# EAGLE design leptonBreakout (EAGLE 6.6.0)
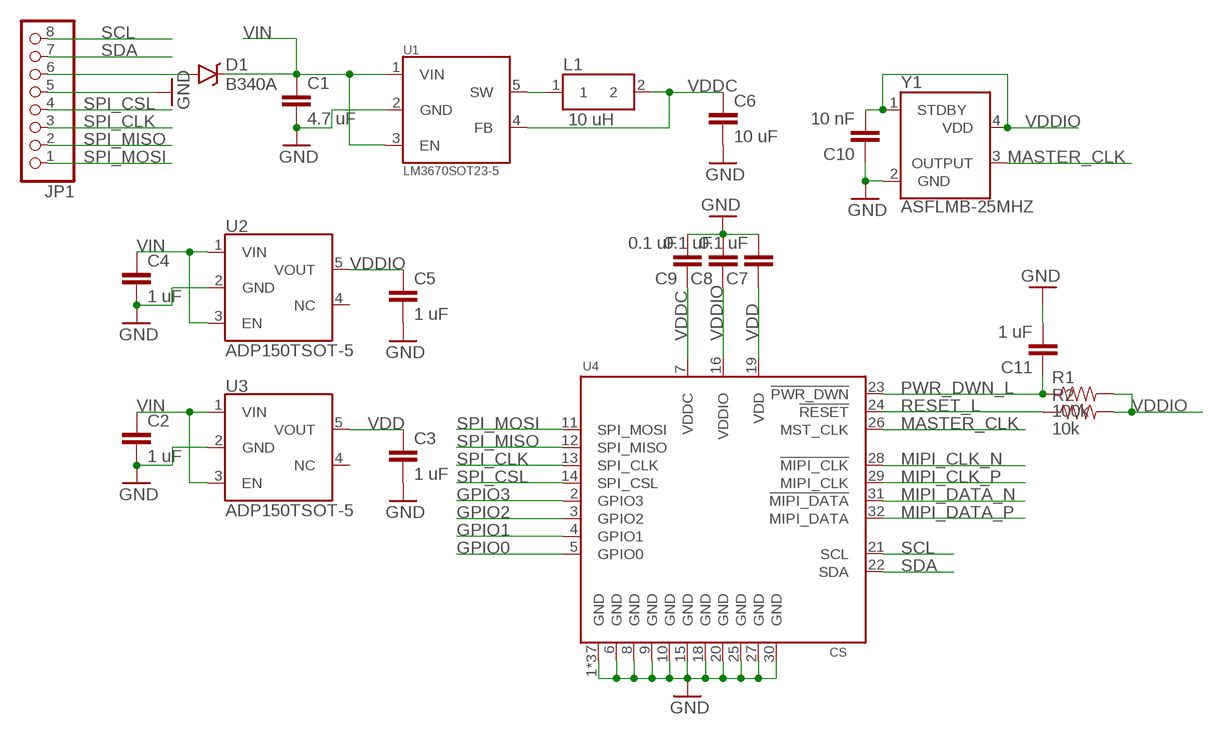
[diagram p0: schematic, sheet 1]

## Parts
C1  4.7 uF  CAP0805  [0805]
C2  1 uF  CAP0805  [0805]
C3  1 uF  CAP0805  [0805]
C4  1 uF  CAP0805  [0805]
C5  1 uF  CAP0805  [0805]
C6  10 uF  CAP0805  [0805]
C7  0.1 uF  CAP0805  [0805]
C8  0.1 uF  CAP0805  [0805]
C9  0.1 uF  CAP0805  [0805]
C10  10 nF  CAP0805  [0805]
C11  1 uF  CAP0805  [0805]
D1  B340A  DIODE-SCHOTTKY-B340A  [SMA-DIODE]
JP1  PINHD-1X8/90  [1X08/90]
L1  10 uH  SMD-INDUCTOR  [SMD-INDUCTOR]
R1  100k  RESISTOR0805-RES  [0805]
R2  10k  RESISTOR0805-RES  [0805]
U1  LM3670SOT23-5  [SOT23-5]
U2  ADP150TSOT-5  [SOT23-5]
U3  ADP150TSOT-5  [SOT23-5]
U4  CS  CAM-MODULE  [CAM-SOCKET]
Y1  ASFLMB-25MHZ  [5X3.2-CRYSTAL-OSC]

## Nets
GND: C1.2 C2.2 C3.2 C4.2 C5.2 C6.2 C7.2 C8.2 C9.2 C10.1 C11.2 JP1.5 U1.2(GND) U2.2(GND) U3.2(GND) U4.1(GND) U4.6(GND) U4.8(GND) U4.9(GND) U4.10(GND) U4.15(GND) U4.18(GND) U4.20(GND) U4.25(GND) U4.27(GND) U4.30(GND) U4.P$1(GND) U4.P$2(GND) U4.P$3(GND) U4.P$4(GND) U4.P$5(GND) U4.P$6(GND) U4.P$7(GND) U4.P$8(GND) U4.P$9(GND) U4.P$10(GND) U4.P$11(GND) U4.P$12(GND) U4.P$13(GND) U4.P$14(GND) U4.P$15(GND) U4.P$16(GND) U4.P$17(GND) U4.P$18(GND) U4.P$19(GND) U4.P$20(GND) U4.P$21(GND) U4.P$22(GND) U4.P$23(GND) U4.P$24(GND) U4.P$25(GND) U4.P$26(GND) U4.P$27(GND) U4.P$28(GND) U4.P$29(GND) U4.P$30(GND) U4.P$31(GND) U4.P$32(GND) U4.P$33(GND) U4.P$34(GND) U4.P$35(GND) U4.P$36(GND) Y1.2(GND)
GPIO0: U4.5(GPIO0)
GPIO1: U4.4(GPIO1)
GPIO2: U4.3(GPIO2)
GPIO3: U4.2(GPIO3)
MASTER_CLK: U4.26(MST_CLK) Y1.3(OUTPUT)
MIPI_CLK_N: U4.28(!MIPI_CLK)
MIPI_CLK_P: U4.29(MIPI_CLK)
MIPI_DATA_N: U4.31(!MIPI_DATA)
MIPI_DATA_P: U4.32(MIPI_DATA)
N$1: L1.1 U1.5(SW)
N$4: D1.A JP1.6
PWR_DWN_L: C11.1 R1.1 U4.23(!PWR_DWN)
RESET_L: R2.1 U4.24(!RESET)
SCL: JP1.8 U4.21(SCL)
SDA: JP1.7 U4.22(SDA)
SPI_CLK: JP1.3 U4.13(SPI_CLK)
SPI_CSL: JP1.4 U4.14(SPI_CSL)
SPI_MISO: JP1.2 U4.12(SPI_MISO)
SPI_MOSI: JP1.1 U4.11(SPI_MOSI)
VDD: C3.1 C7.1 U3.5(VOUT) U4.19(VDD)
VDDC: C6.1 C9.1 L1.2 U1.4(FB) U4.7(VDDC)
VDDIO: C5.1 C8.1 C10.2 R1.2 R2.2 U2.5(VOUT) U4.16(VDDIO) Y1.1(STDBY) Y1.4(VDD)
VIN: C1.1 C2.1 C4.1 D1.C U1.1(VIN) U1.3(EN) U2.1(VIN) U2.3(EN) U3.1(VIN) U3.3(EN)
Unconnected: U2.4(NC) U3.4(NC)

## Library data of the parts
C1-C11 = SparkFun-Capacitors:CAP: Capacitor Standard 0603 ceramic capacitor, and 0.1" leaded capacitor.
D1 = leptonCustom:DIODE-SCHOTTKY: Schottky diodes in SFE's production catalog BAT20J 1A 23V 0.62Vf RB751 120mA 40V 0.37Vf PMEG4005EJ 0.5A 40V 0.42Vf MBRA140 1A 40V 0.5Vf B340A 3A 40V SMA; PROD_ID: DIO-09886
JP1 = pinhead:PINHD-1X8: PIN HEADER
L1 = leptonCustom:SMD-INDUCTOR
R1 R2 = SparkFun-Resistors:RESISTOR: Resistor Basic schematic elements and footprints for 0603, 1206, and PTH resistors.
U1 = leptonCustom:LM3670: LM3670 1.2V 350mA Mini Buck Converter TI LM3670MF-1.2/NOPB
U2 U3 = leptonCustom:ADP150: ADP150 2.8V 150mA Linear LDO Regulator Analog Devices ADP150AUJZ-2.8-R7
U4 = leptonCustom:CAM-MODULE: FLIR Lepton 80x60 LWIR camera module.
Y1 = leptonCustom:ASFLMB-25MHZ: 25 MHz crystal oscillator.

## Board
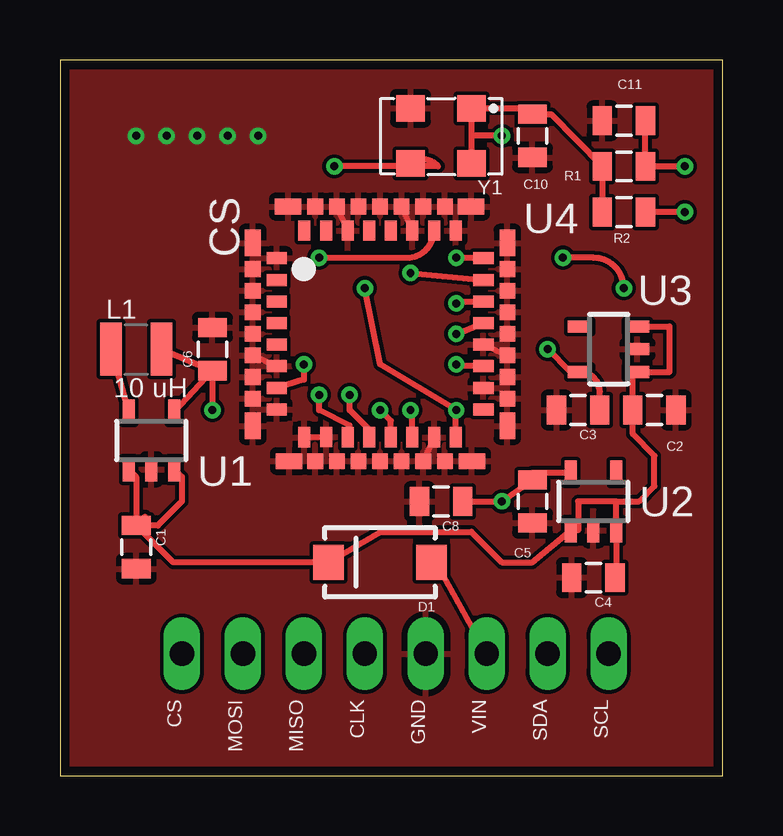
[diagram p1: board, top side]
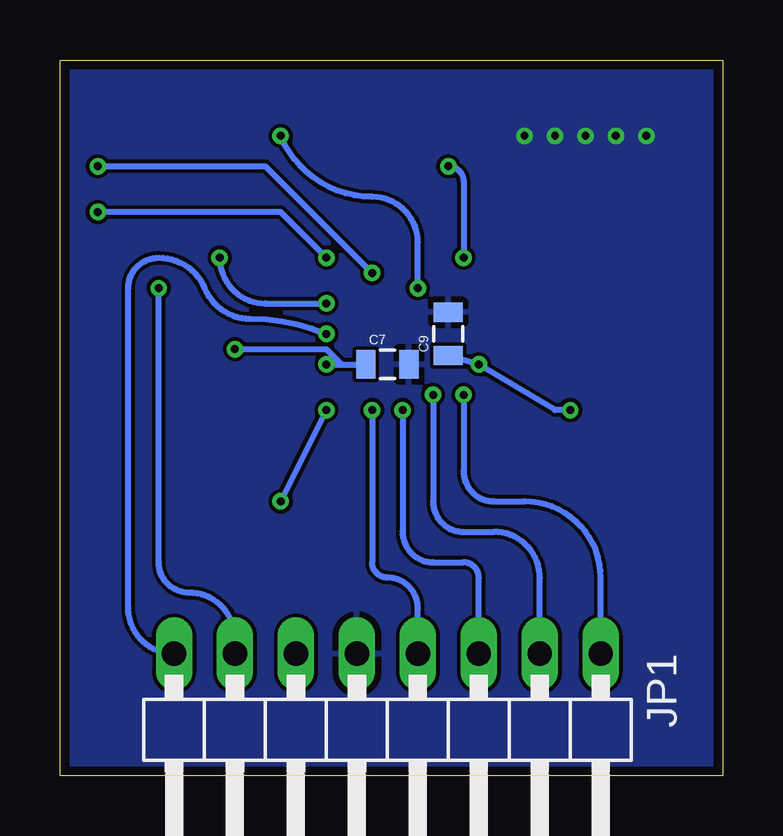
[diagram p2: board, bottom side, seen from below]

Size 27.61 x 29.84 mm. Coordinates in mm from the lower left corner, seen from the top.
Outline: 0,0 27.61,0 27.61,29.84 0,29.84 0,0
Copper layers (1*16): Top 0.0356mm / dielectric 1.5011mm / Bottom 0.0356mm
Design rules "LaenPCBOrder *": minimum track width 6mil, minimum drill 13mil, track to track 6mil, track to pad 6mil, pad to pad 6mil, via to via 6mil, smd to smd 6mil, copper to edge 15mil, drill to drill 6mil, minimum pad ring 7mil, minimum via ring 7mil, stop-mask expansion 3mil, vias tented up to drill 14mil, thermal gap 10mil

### Footprints (pad centres in the part's own frame; a part is rotated, then mirrored left to right if it is on the bottom)
0805 = smd 0.8 x 1.2: 1 -0.9,0; 2 0.9,0
SMA-DIODE = smd 1.27 x 1.47: A -2.15,0; C 2.15,0
1X08/90 = drill 1.016 long: 1 -8.89,-3.81; 2 -6.35,-3.81; 3 -3.81,-3.81; 4 -1.27,-3.81; 5 1.27,-3.81; 6 3.81,-3.81; 7 6.35,-3.81; 8 8.89,-3.81
SMD-INDUCTOR = smd 0.9 x 2.2: 1 -1.05,0; 2 1.05,0
SOT23-5 = smd 0.5 x 1: 1 -0.95,-1.2; 2 0,-1.2; 3 0.95,-1.2; 4 0.95,1.2; 5 -0.95,1.2
CAM-SOCKET = smd 0.5 x 0.84: 1 -3.15,-4.31; 2 -2.25,-4.31; 3 -1.35,-4.31; 4 -0.45,-4.31; 5 0.45,-4.31; 6 1.35,-4.31; 7 2.25,-4.31; 8 3.15,-4.31; 17 3.15,4.31; 18 2.25,4.31; 19 1.35,4.31; 20 0.45,4.31; 21 -0.45,4.31; 22 -1.35,4.31; 23 -2.25,4.31; 24 -3.15,4.31 | smd 0.84 x 0.5: 9 4.31,-3.15; 10 4.3,-2.25; 11 4.31,-1.35; 12 4.31,-0.45; 13 4.31,0.45; 14 4.31,1.35; 15 4.31,2.25; 16 4.31,3.15; 25 -4.31,3.15; 26 -4.31,2.25; 27 -4.31,1.35; 28 -4.31,0.45; 29 -4.31,-0.45; 30 -4.31,-1.35; 31 -4.31,-2.25; 32 -4.31,-3.15 | smd 0.65 x 0.65: P$1 -5.305,2.7; P$3 -5.305,1.8; P$4 -5.305,0.9; P$5 -5.305,0; P$6 -5.305,-0.9; P$7 -5.305,-1.8; P$8 -5.305,-2.7; P$11 -2.7,5.305; P$12 -1.8,5.305; P$13 -0.9,5.305; P$14 0,5.305; P$15 0.9,5.305; P$16 1.8,5.305; P$17 2.7,5.305; P$20 5.305,-2.7; P$21 5.305,-1.8; P$22 5.305,-0.9; P$23 5.305,0; P$24 5.305,0.9; P$25 5.305,1.8; P$26 5.305,2.7; P$29 -2.7,-5.305; P$30 -1.8,-5.305; P$31 -0.9,-5.305; P$32 0,-5.305; P$33 0.9,-5.305; P$34 1.8,-5.305; P$35 2.7,-5.305 | smd 0.65 x 1.1: P$2 -5.305,-3.83; P$9 -5.305,3.79; P$19 5.305,3.83; P$27 5.305,-3.79 | smd 1.1 x 0.65: P$10 3.83,5.305; P$18 -3.79,5.305; P$28 3.83,-5.305; P$36 -3.79,-5.305
5X3.2-CRYSTAL-OSC = smd 1.2 x 1.1: 1 -1.27,-1.15; 2 1.27,-1.15; 3 1.27,1.15; 4 -1.27,1.15

### Placement (x,y rotation side)
C1  3.17,9.53 270 top
C2  24.77,15.24 0 top
C3  21.59,15.24 180 top
C4  22.23,8.26 180 top
C5  19.68,11.43 270 top
C6  6.35,17.78 90 top
C7  13.97,17.14 0 bottom
C8  15.88,11.43 180 top
C9  11.43,18.41 90 bottom
C10  19.68,26.67 90 top
C11  23.5,27.3 180 top
D1  13.34,8.89 180 top
JP1  13.97,1.27 180 bottom
L1  3.17,17.78 0 top
R1  23.5,25.4 180 top
R2  23.5,23.5 180 top
U1  3.81,13.97 0 top
U2  22.23,11.43 0 top
U3  22.86,17.78 90 top
U4  13.34,18.41 270 top
Y1  15.88,26.67 180 top

### Tracks (layer width: path | path; a pad name or v marks a point on that pad's centre or on a via)
GND  (via drill 0.33)
  Top 0.254: U4.P$4 U4.27 | U4.P$15 U4.20 | U4.P$33 U4.6 | U4.10 U4.9 | U4.P$25 U4.15 | U4.30 U4.P$7
  Bottom 0.254: 13.34,17.41 C7.2
  other vias: 3.17,26.67 6.99,26.67 8.26,26.67 4.45,26.67 5.71,26.67
  pour Top: 0,0 0,29.84 27.94,29.84 27.94,0
  pour Bottom: 0,29.84 27.94,29.84 27.94,0 0,0
MASTER_CLK  (via drill 0.33)
  Top 0.254: Y1.3 arc-90 15.76,25.4 v11.43,25.4 | v10.79,21.59 14.45,21.59 arc90 U4.26
  Bottom 0.254: v11.43,25.4 arc90 10.79,24.77 v10.79,21.59
N$1
  Top 0.254: U1.5 L1.1
N$4
  Top 0.254: JP1.6 15.88,8.5 arc90 D1.A
PWR_DWN_L  (via drill 0.33)
  Top 0.254: v14.61,20.95 U4.23 | C11.1 R1.1 v26.04,25.4
  Bottom 0.254: v26.04,25.4 19.05,25.4 v14.61,20.95
RESET_L  (via drill 0.33)
  Top 0.254: v16.51,21.59 17.62,21.59 arc-90 U4.24 | v26.04,23.5 R2.1
  Bottom 0.254: v16.51,21.59 18.41,23.5 v26.04,23.5
SCL  (via drill 0.33)
  Top 0.254: v16.51,18.41 U4.21
  Bottom 0.254: v16.51,18.41 arc-23 19.68,19.05 arc67 21.59,20.32 arc-67 23.5,21.59 arc-90 24.77,20.32 24.77,6.99 arc-90 JP1.8
SDA  (via drill 0.33)
  Top 0.254: v23.5,20.32 arc90 22.23,21.59 v20.95,21.59 | v16.51,19.68 arc-90 16.59,19.77 U4.22
  Bottom 0.254: v23.5,20.32 23.5,8.89 arc-90 22.23,7.62 arc90 20.32,5.71 JP1.7 | v20.95,21.59 arc-90 19.05,19.68 v16.51,19.68
SPI_CLK  (via drill 0.33)
  Top 0.254: U4.13 13.79,14.79 v13.34,15.24
  Bottom 0.254: v13.34,15.24 13.34,10.16 arc-90 12.06,8.89 10.79,8.89 arc90 10.16,8.26 JP1.3
SPI_CSL  (via drill 0.33)
  Top 0.254: U4.14 14.69,15.24 v14.61,15.24
  Bottom 0.254: v14.61,15.24 14.61,8.89 arc-90 13.97,8.26 arc90 12.7,6.99 JP1.4
SPI_MISO  (via drill 0.33)
  Top 0.254: U4.12 12.88,14.42 12.06,15.24 v12.06,15.88
  Bottom 0.254: v12.06,15.88 12.06,11.43 arc-90 10.79,10.16 9.53,10.16 arc90 7.62,8.26 JP1.2
SPI_MOSI  (via drill 0.33)
  Top 0.254: U4.11 12.06,14.61 10.79,15.24 v10.79,15.88
  Bottom 0.254: v10.79,15.88 10.79,12.7 arc-90 9.53,11.43 8.26,11.43 arc90 5.08,8.26 JP1.1
VDD  (via drill 0.33)
  Top 0.254: U4.19 16.51,17.07 v16.51,17.14 | C3.1 22.49,16 arc90 U3.5 21.27,16.83 v20.32,17.78
  Bottom 0.254: v16.51,17.14 15.88,17.14 | 15.88,17.14 C7.1 | v20.32,17.78 16.51,17.78 15.88,17.14
VDDC  (via drill 0.33)
  Top 0.254: L1.2 C6.1 | U1.4 C6.1 | C6.1 v6.35,15.24 | v10.16,17.14 10.16,16.51 U4.7
  Bottom 0.254: v6.35,15.24 6.99,15.24 v10.16,17.14 C9.1
VDDIO  (via drill 0.33)
  Top 0.254: U2.5 19.68,12.63 C5.1 v18.41,11.43 C8.1 | U4.16 16.48,15.21 v16.51,15.24 13.34,17.14 v12.7,20.32 | 17.14,26.67 Y1.1 19.68,27.82 C10.2 20.48,27.57 R1.2 R2.2 | 17.14,26.67 Y1.4 | v18.41,26.67 17.14,26.67
  Bottom 0.254: v16.51,15.24 v18.41,11.43 | v12.7,20.32 12.7,22.23 arc-90 14.61,24.13 arc67 v18.41,26.67
VIN
  Top 0.254: U3.3 25.4,18.73 25.4,16.83 U3.1 arc90 23.86,16.64 C2.1 23.86,14.23 24.77,13.34 24.77,12.06 24.13,11.43 23.18,11.43 | 23.18,11.43 U2.3 23.18,8.26 C4.1 | 23.18,11.43 21.59,11.43 21.59,10.23 U2.1 19.68,8.89 18.41,8.89 17.14,10.16 13.34,10.16 D1.C 4.71,8.89 C1.1 | 3.54,10.79 C1.1 | U1.1 3.17,12.46 C1.1 | U1.3 5.08,12.45 5.08,11.43 4.08,10.43 C1.1

### Text on the board
tPlace: CS | MOSI | MISO | CLK | GND | VIN | SDA | SCL